# EAGLE design coffe (EAGLE 9.6.2)
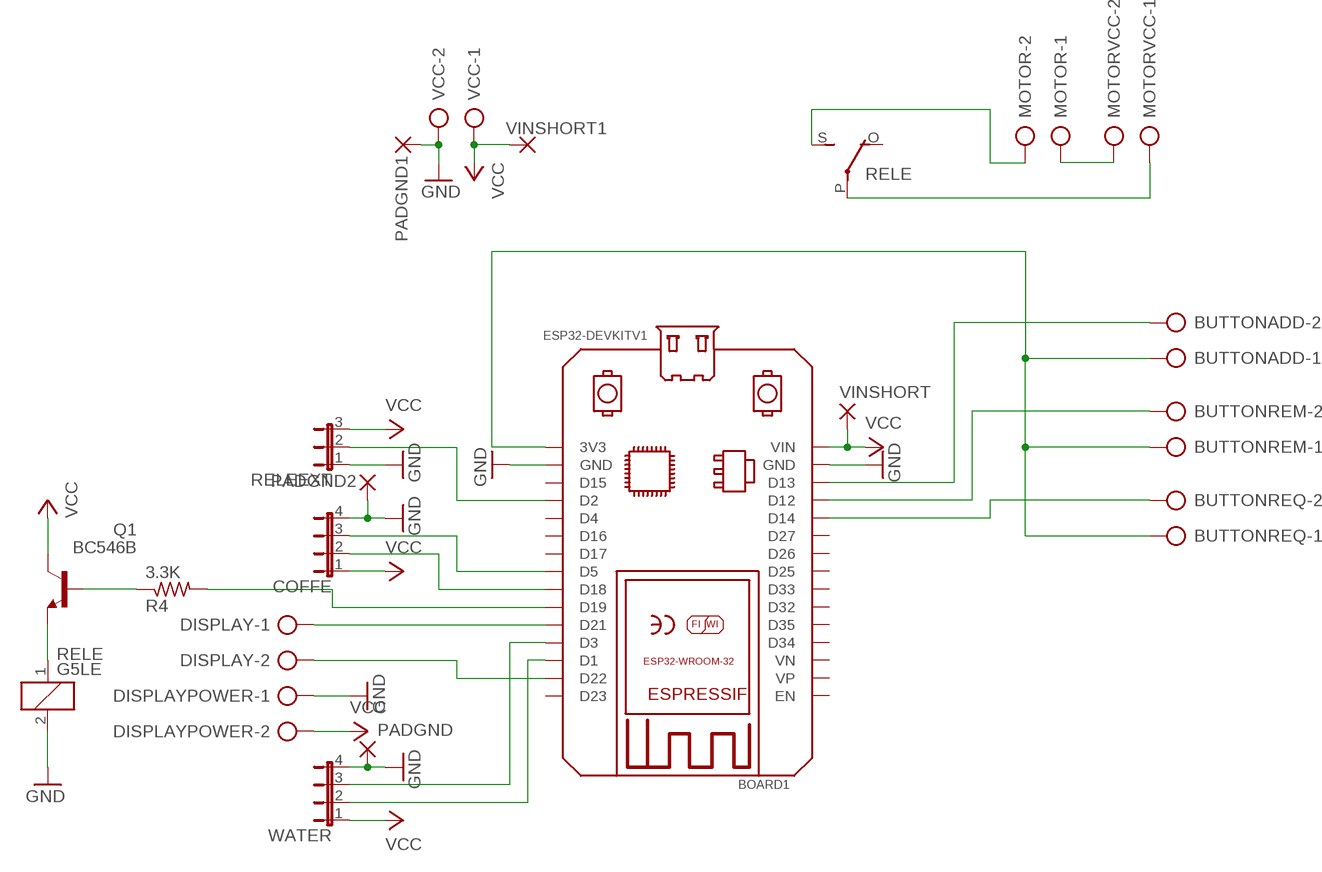
[diagram p0: schematic, sheet 1]

## Parts
BOARD1  ESP32DEVKITV1  [ESP32-DEVKITV1]
BUTTONADD  AK500/2-H  [AK500/2-H]
BUTTONREM  AK500/2-H  [AK500/2-H]
BUTTONREQ  AK500/2-H  [AK500/2-H]
COFFE  JP4E  [JP4]
DISPLAY  AK500/2-H  [AK500/2-H]
DISPLAYPOWER  AK500/2-H  [AK500/2-H]
MOTOR  AK500/2-H  [AK500/2-H]
MOTORVCC  AK500/2-H  [AK500/2-H]
PADGND  2,15/1,0  [2,15/1,0]
PADGND1  2,15/1,0  [2,15/1,0]
PADGND2  2,15/1,0  [2,15/1,0]
Q1  BC546B  [TO92-EBC]
R4  3.3K  R-US_0204/7  [0204/7]
RELE  G5LE  [G5LE]
RELEEXT  JP2E  [JP2]
VCC  AK500/2-H  [AK500/2-H]
VINSHORT  2,15/1,0  [2,15/1,0]
VINSHORT1  2,15/1,0  [2,15/1,0]
WATER  JP4E  [JP4]

## Nets
GND: BOARD1.GND BOARD1.GND@1(GND) COFFE.4 DISPLAYPOWER.1 PADGND1.1(P) PADGND2.1(P) PADGND.1(P) RELE.2 RELEEXT.1 VCC.2 WATER.4
N$1: BOARD1.D3 WATER.3
N$2: BOARD1.D1 WATER.2
N$3: BOARD1.D5 COFFE.3
N$4: BOARD1.D18 COFFE.2
N$5: BOARD1.D14 BUTTONREQ.2
N$6: BOARD1.D19 R4.2
N$7: BOARD1.3V3 BUTTONADD.1 BUTTONREM.1 BUTTONREQ.1
N$8: BOARD1.D22 DISPLAY.2
N$9: Q1.B R4.1
N$10: Q1.E RELE.1
N$11: MOTOR.2 RELE.S(2:S)
N$12: MOTOR.1 MOTORVCC.2
N$13: MOTORVCC.1 RELE.P(2:P)
N$14: BOARD1.D2 RELEEXT.2
N$16: BOARD1.D13 BUTTONADD.2
N$17: BOARD1.D21 DISPLAY.1
N$18: BOARD1.D12 BUTTONREM.2
VCC: BOARD1.VIN COFFE.1 DISPLAYPOWER.2 Q1.C RELEEXT.3 VCC.1 VINSHORT1.1(P) VINSHORT.1(P) WATER.1
Unconnected: BOARD1.D4 BOARD1.D15 BOARD1.D16 BOARD1.D17 BOARD1.D23 BOARD1.D25 BOARD1.D26 BOARD1.D27 BOARD1.D32 BOARD1.D33 BOARD1.D34 BOARD1.D35 BOARD1.EN BOARD1.VN BOARD1.VP RELE.O(2:O)

## Library data of the parts
BOARD1 = ESP32-DEVKITV1-BEST:ESP32DEVKITV1: https://github.com/shridattdudhat
BUTTONADD BUTTONREM BUTTONREQ DISPLAY DISPLAYPOWER MOTOR MOTORVCC VCC = con-ptr500:AK500/2-H: CONNECTOR Aug. 2004 / PTR Meßtechnik: Die Bezeichnung der Serie AK505 wurde geändert. Es handelt sich hierbei um AK500 in horizontaler Ausführung.; OC_FARNELL: unknown; OC_NEWARK: unknown
COFFE WATER = jumper:JP4E: JUMPER
PADGND PADGND1 PADGND2 VINSHORT VINSHORT1 = wirepad:2,15/1,0: THROUGH-HOLE PAD
Q1 = transistor-npn:BC546*: NPN Transistor
R4 = rcl:R-US_: RESISTOR, American symbol; SPICEPREFIX: R
RELE = relay:G5LE: RELAY 1 x switch, 10 A/120 V AC, 8 A/30 V DC, Omron; OC_FARNELL: unknown; OC_NEWARK: unknown
RELEEXT = jumper:JP2E: JUMPER

## Board
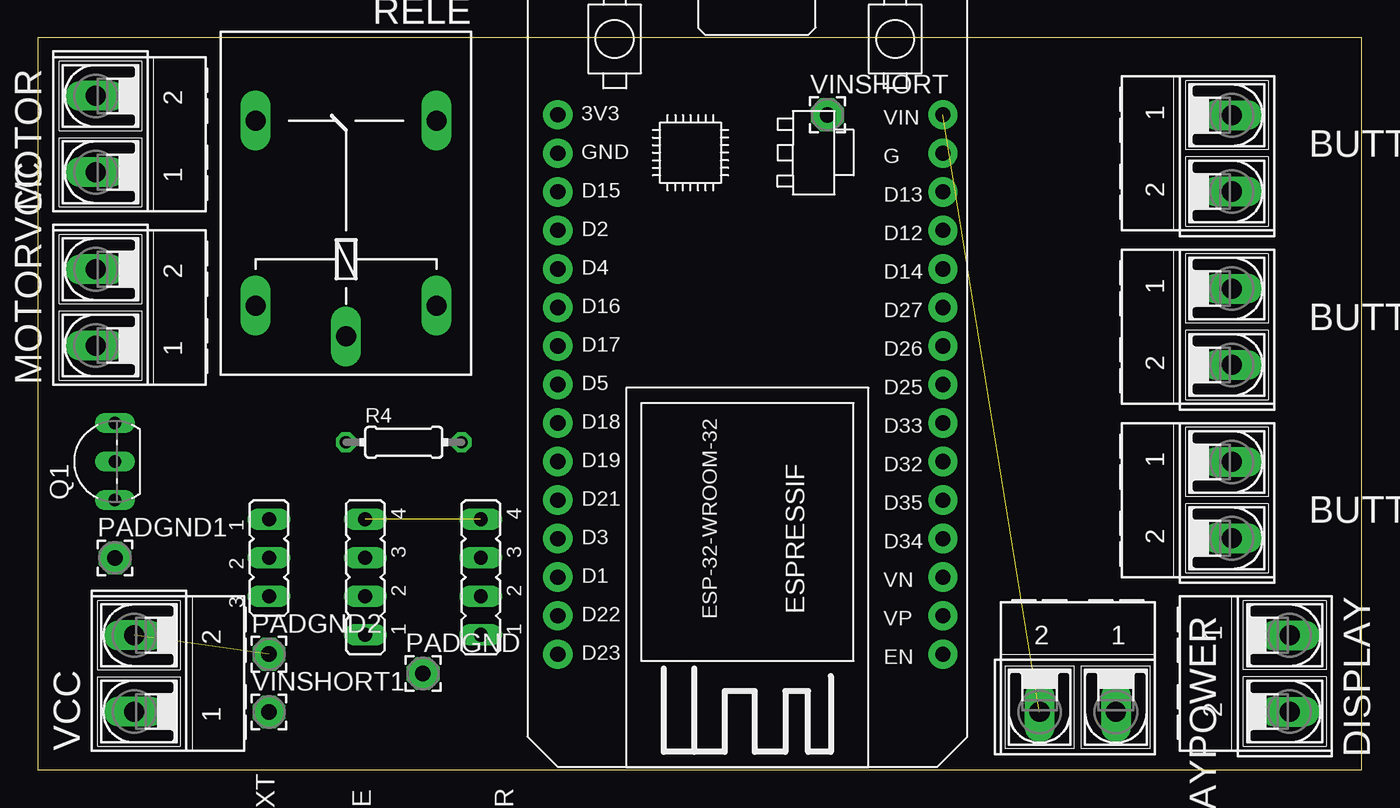
[diagram p1: board, top side]
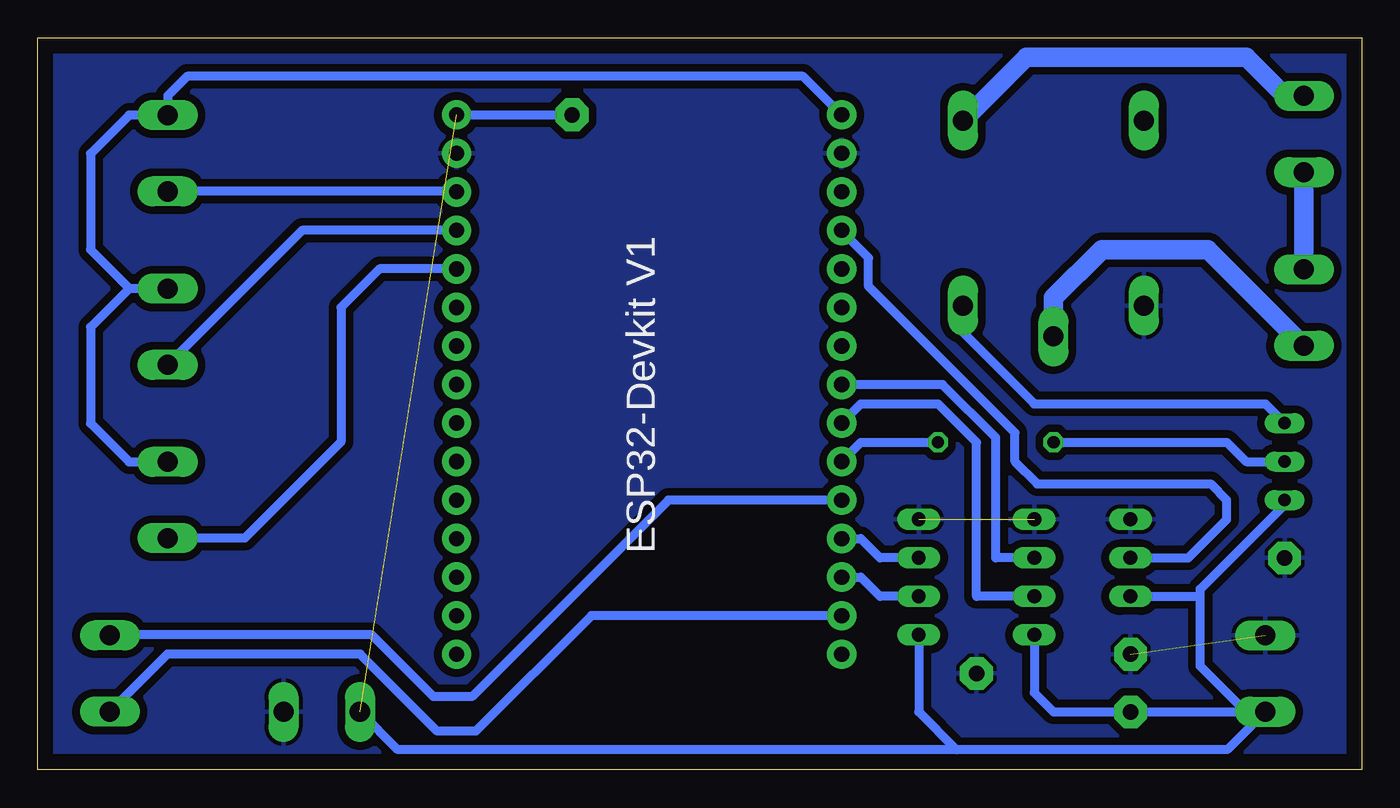
[diagram p2: board, bottom side, seen from below]

Size 87.3 x 48.25 mm. Coordinates in mm from the lower left corner, seen from the top.
Outline: 0,0 87.3,0 87.3,48.25 0,48.25 0,0
Copper layers (1*16): Top 0.035mm / dielectric 1.5mm / Bottom 0.035mm
Design rules "default *": minimum track width 24mil, minimum drill 0.35mm, track to track 20mil, track to pad 20mil, pad to pad 20mil, via to via 20mil, smd to smd 10mil, copper to edge 40mil, drill to drill 8mil, minimum pad ring 10mil, minimum via ring 8mil, stop-mask expansion 4mil, vias tented up to drill 0mil, thermal gap 10mil

### Footprints (pad centres in the part's own frame; a part is rotated, then mirrored left to right if it is on the bottom)
ESP32-DEVKITV1 = drill 1 pad 1.93: 3V3 0,0; D1 30.48,0; D2 7.62,0; D3 27.94,0; D4 10.16,0; D5 17.78,0; D12 7.62,25.4; D13 5.08,25.4; D14 10.16,25.4; D15 5.08,0; D16 12.7,0; D17 15.24,0; D18 20.32,0; D19 22.86,0; D21 25.4,0; D22 33.02,0; D23 35.56,0; D25 17.78,25.4; D26 15.24,25.4; D27 12.7,25.4; D32 22.86,25.4; D33 20.32,25.4; D34 27.94,25.4; D35 25.4,25.4; EN 35.56,25.4; GND 2.54,25.4; GND@1 2.54,0; VIN 0,25.4; VN 30.48,25.4; VP 33.02,25.4
AK500/2-H = drill 1.321 long: 1 -2.515,0; 2 2.515,0
JP4 = drill 0.914 long: 1 -3.81,0; 2 -1.27,0; 3 1.27,0; 4 3.81,0
2,15/1,0 = drill 1.016 pad 2.159 octagon: 1 0,0
TO92-EBC = drill 0.813 long: B 0,-1.27; C -2.54,-1.27; E 2.54,-1.27
0204/7 = drill 0.813 octagon: 1 -3.81,0; 2 3.81,0
G5LE = drill 1.321 long: 1 -7.493,-5.969; 2 -7.493,5.969; O 4.699,5.969; P -9.525,0; S 4.699,-5.969
JP2 = drill 0.914 long: 1 -2.54,0; 2 0,0; 3 2.54,0

### Placement (x,y rotation side)
BOARD1  34.29,43.18 270 top
BUTTONADD  78.74,40.64 270 top
BUTTONREM  78.74,29.21 270 top
BUTTONREQ  78.74,17.78 270 top
COFFE  21.59,12.7 90 top
DISPLAY  82.55,6.35 270 top
DISPLAYPOWER  68.58,3.81 180 top
MOTOR  3.81,41.91 90 top
MOTORVCC  3.81,30.48 90 top
PADGND  25.4,6.35 0 top
PADGND1  5.08,13.97 0 top
PADGND2  15.24,7.62 0 top
Q1  3.81,20.32 90 top
R4  24.13,21.59 0 top
RELE  20.32,38.1 90 top
RELEEXT  15.24,13.97 270 top
VCC  6.35,6.35 90 top
VINSHORT  52.07,43.18 0 top
VINSHORT1  15.24,3.81 0 top
WATER  29.21,12.7 90 top

### Tracks (layer width: path | path; a pad name or v marks a point on that pad's centre or on a via)
GND  (2 unrouted)
  pour Bottom (isolate 0.305): 0,48.26 87.63,48.26 87.63,0 0,0
N$1
  Bottom 0.61: WATER.3 31.75,13.97 33.02,15.24 BOARD1.D3
N$2
  Bottom 0.61: WATER.2 31.75,11.43 33.02,12.7 BOARD1.D1
N$3
  Bottom 0.61: COFFE.3 24.13,13.97 24.13,21.9 27.63,25.4 BOARD1.D5
N$4
  Bottom 0.61: COFFE.2 25.4,11.43 25.4,21.59 27.94,24.13 33.02,24.13 BOARD1.D18
N$5
  Bottom 0.61: BOARD1.D14 64.77,33.02 67.31,30.48 67.31,21.61 73.66,15.27 BUTTONREQ.2
N$6
  Bottom 0.61: BOARD1.D19 33.02,21.59 R4.2
N$7
  Bottom 0.61: BUTTONREQ.1 81.28,20.3 83.82,22.84 83.82,29.18 81.28,31.73 BUTTONREM.1 81.25,31.73 83.82,34.29 83.82,40.62 81.28,43.16 BUTTONADD.1 78.74,44.45 77.47,45.72 36.83,45.72 BOARD1.3V3
N$8
  Bottom 0.61: BOARD1.D22 50.8,10.16 58.42,2.54 60.96,2.54 66.04,7.62 78.77,7.62 DISPLAY.2
N$9
  Bottom 0.61: R4.1 8.89,21.59 7.62,20.32 Q1.B
N$10
  Bottom 0.61: Q1.E 6.35,24.13 21.59,24.13 26.29,28.83 RELE.1
N$11
  Bottom 1.27: MOTOR.2 5.08,44.42 7.62,46.97 22.12,46.97 RELE.S
N$12
  Bottom 1.27: MOTORVCC.2 MOTOR.1
N$13
  Bottom 1.27: RELE.P 20.32,31.11 17.14,34.29 10.13,34.29 MOTORVCC.1
N$14
  Bottom 0.61: RELEEXT.2 11.43,13.97 8.89,16.51 8.89,17.78 9.96,18.85 21.39,18.85 22.86,20.32 22.86,22.21 32.51,31.86 32.51,33.76 34.29,35.53 BOARD1.D2
N$16
  Bottom 0.61: BOARD1.D13 59.72,38.12 BUTTONADD.2
N$17
  Bottom 0.61: DISPLAY.1 82.53,8.89 65.28,8.89 61.21,4.83 58.67,4.83 45.72,17.78 BOARD1.D21
N$18
  Bottom 0.61: BOARD1.D12 69.88,35.56 BUTTONREM.2
VCC  (1 unrouted)
  Bottom 0.61: VCC.1 8.87,1.32 26.67,1.32 26.72,1.32 | 26.72,1.32 63.58,1.32 DISPLAYPOWER.2 | BOARD1.VIN VINSHORT.1 | VCC.1 6.38,3.81 VINSHORT1.1 20.32,3.81 21.59,5.08 COFFE.1 | Q1.C 5.08,17.49 10.65,11.92 10.65,11.43 | VCC.1 7.64,3.83 10.65,6.84 10.65,11.43 | RELEEXT.3 10.65,11.43 | WATER.1 29.21,3.81 26.72,1.32